# EAGLE design linefollower analog (EAGLE 6.6.0)
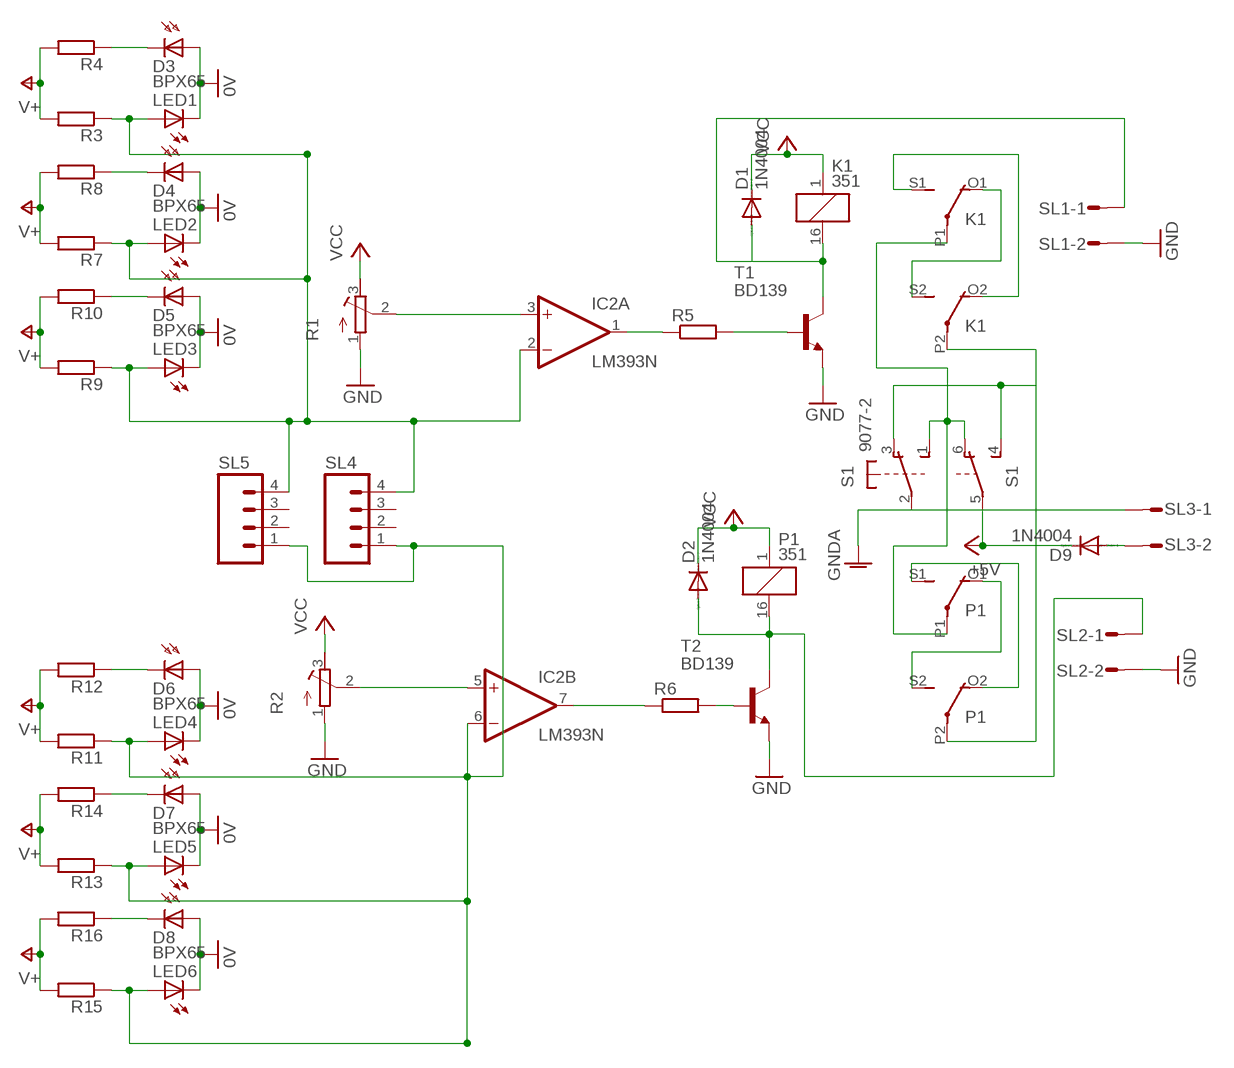
[diagram p0: schematic, sheet 1]

## Parts
D1  1N4004  [DO41-10]
D2  1N4004  [DO41-10]
D3  BPX65  [BPX65]
D4  BPX65  [BPX65]
D5  BPX65  [BPX65]
D6  BPX65  [BPX65]
D7  BPX65  [BPX65]
D8  BPX65  [BPX65]
D9  1N4004  [DO41-10]
IC2  LM393N  [DIL08]
K1  351  [351]
LED1  LED5MM  [LED5MM]
LED2  LED5MM  [LED5MM]
LED3  LED5MM  [LED5MM]
LED4  LED5MM  [LED5MM]
LED5  LED5MM  [LED5MM]
LED6  LED5MM  [LED5MM]
P1  351  [351]
R1  R-TRIMM3339P  [RTRIM3339P]
R2  R-TRIMM3339P  [RTRIM3339P]
R3  R-EU_0204/7  [0204/7]
R4  R-EU_0204/7  [0204/7]
R5  R-EU_0207/7  [0207/7]
R6  R-EU_0207/7  [0207/7]
R7  R-EU_0204/7  [0204/7]
R8  R-EU_0204/7  [0204/7]
R9  R-EU_0204/7  [0204/7]
R10  R-EU_0204/7  [0204/7]
R11  R-EU_0204/7  [0204/7]
R12  R-EU_0204/7  [0204/7]
R13  R-EU_0204/7  [0204/7]
R14  R-EU_0204/7  [0204/7]
R15  R-EU_0204/7  [0204/7]
R16  R-EU_0204/7  [0204/7]
S1  9077-2  [9077-2]
SL1  M02S  [02P]
SL2  M02S  [02P]
SL3  M02S  [02P]
SL4  M04  [04P]
SL5  M04  [04P]
T1  BD139  [TO126]
T2  BD139  [TO126]

## Nets
0V: D3.A D4.A D5.A D6.A D7.A D8.A LED1.K(C) LED2.K(C) LED3.K(C) LED4.K(C) LED5.K(C) LED6.K(C)
+5V: D9.C S1.2(1:P) SL3.1 ; supply symbol labelled GNDA
GND: R1.1(E) R2.1(E) SL1.2 SL2.2 T1.1(E) T2.1(E)
N$1: IC2.3(A:+IN) R1.2(S)
N$2: IC2.5(B:+IN) R2.2(S)
N$3: IC2.7(B:OUT) R6.1
N$4: IC2.1(A:OUT) R5.1
N$5: R5.2 T1.3(B)
N$6: R6.2 T2.3(B)
N$7: IC2.6(B:-IN) LED4.A LED5.A LED6.A R11.1 R13.1 R15.1 SL4.1 SL5.1
N$8: D1.A K1.16 SL1.1 T1.2(C)
N$10: D9.A SL3.2
N$11: K1.O2(3:O) K1.S1(2:S)
N$12: K1.O1(2:O) K1.S2(3:S)
N$13: K1.P1(2:P) P1.P1(2:P) S1.1(1:S) S1.6(2:O)
N$14: K1.P2(3:P) P1.P2(3:P) S1.3(1:O) S1.4(2:S)
N$15: P1.O2(3:O) P1.S1(2:S)
N$16: P1.O1(2:O) P1.S2(3:S)
N$18: D3.K(C) R4.1
N$19: IC2.2(A:-IN) LED1.A LED2.A LED3.A R3.1 R7.1 R9.1 SL4.4 SL5.4
N$22: D4.K(C) R8.1
N$26: D5.K(C) R10.1
N$30: D6.K(C) R12.1
N$34: D7.K(C) R14.1
N$38: D8.K(C) R16.1
P1: D2.A P1.16 SL2.1 T2.2(C)
V+: R3.2 R4.2 R7.2 R8.2 R9.2 R10.2 R11.2 R12.2 R13.2 R14.2 R15.2 R16.2
VCC: D1.C D2.C K1.1 P1.1 R1.3(A) R2.3(A)
Unconnected: S1.5(2:P) SL4.2 SL4.3 SL5.2 SL5.3

## Power pins joined to a net without a drawn wire
GND: IC2.4(P:V-)
VCC: IC2.8(P:V+)

## Library data of the parts
D1 D2 D9 = diode:1N4004: DIODE general purpose rectifier, 1 A
D3-D8 = opto-trans-siemens:BPX65: PHOTO DIODE; MPN: BPX65.; OC_FARNELL: 327451; OC_NEWARK: 06WX2764
IC2 = linear:LM393: COMPARATOR
K1 P1 = relay:351: RELAY 2 x switch, Omron; OC_FARNELL: unknown; OC_NEWARK: unknown
LED1-LED6 = led:LED: LED OSRAM: - CHIPLED LG R971, LG N971, LY N971, LG Q971, LY Q971, LO R971, LY R971 LH N974, LH R974 LS Q976, LO Q976, LY Q976 LO Q996 - Hyper CHIPLED LW Q18S LB Q993, LB Q99A, LB R99A - SideLED LS A670, LO A670, LY A670, LG A670, LP A670 LB A673, LV A673, LT A673, LW A673 LH A674 LY A675 LS A676, LA A676, LO A676, LY A676, LW A676 LS A679, LY A679, LG A679 - Hyper Micro SIDELED® LS Y876, LA Y876, LO Y876, LY Y876 LT Y87S - SmartLED LW L88C, LW L88S LB L89C, LB L89S, LG L890 LS L89K, LO L89K, LY L89K LS L896, LA L896, LO L896, LY L896 - TOPLED LS T670, LO T670, LY T670, LG T670, LP T670 LSG T670, LSP T670, LSY T670, LOP T670, LYG T670 LG T671, LOG T671, LSG T671 LB T673, LV T673, LT T673, LW T673 LH T674 LS T676, LA T676, LO T676, LY T676, LB T676, LH T676, LSB T676, LW T676 LB T67C, LV T67C, LT T67C, LS T67K, LO T67K, LY T67K, LW E67C LS E67B, LA E67B, LO E67B, LY E67B, LB E67C, LV E67C, LT E67C LW T67C LS T679, LY T679, LG T679 LS T770, LO T770, LY T770, LG T770, LP T770 LB T773, LV T773, LT T773, LW T773 LH T774 LS E675, LA E675, LY E675, LS T675 LS T776, LA T776, LO T776, LY T776, LB T776 LHGB T686 LT T68C, LB T68C - Hyper Mini TOPLED® LB M676 - Mini TOPLED Santana® LG M470 LS M47K, LO M47K, LY M47K Source: http://www.osram.convergy.de LUXEON: - LUMILED® LXK2-PW12-R00, LXK2-PW12-S00, LXK2-PW14-U00, LXK2-PW14-V00 LXK2-PM12-R00, LXK2-PM12-S00, LXK2-PM14-U00 LXK2-PE12-Q00, LXK2-PE12-R00, LXK2-PE12-S00, LXK2-PE14-T00, LXK2-PE14-U00 LXK2-PB12-K00, LXK2-PB12-L00, LXK2-PB12-M00, LXK2-PB14-N00, LXK2-PB14-P00, LXK2-PB14-Q00 LXK2-PR12-L00, LXK2-PR12-M00, LXK2-PR14-Q00, LXK2-PR14-R00 LXK2-PD12-Q00, LXK2-PD12-R00, LXK2-PD12-S00 LXK2-PH12-R00, LXK2-PH12-S00 LXK2-PL12-P00, LXK2-PL12-Q00, LXK2-PL12-R00 Source: www.luxeon.com KINGBRIGHT: KA-3528ASYC Source: www.kingbright.com
R1 R2 = resistor:R-TRIMM: Trimm resistor
R3-R16 = resistor:R-EU_: RESISTOR, European symbol
S1 = switch-misc:9077-2: MARQUARDT SWITCH 9077.0200 Distributor: Buerklin <https://www.buerklin.com/default.asp?event=ShowArtikel%2812G2822%29&l=d&jump=ArtNr_12G2822>
SL1-SL3 = con-amp-quick:M02S: AMP QUICK CONNECTOR; OC_FARNELL: unknown; OC_NEWARK: unknown
SL4 SL5 = con-amp-quick:M04: AMP QUICK CONNECTOR; OC_FARNELL: unknown; OC_NEWARK: unknown
T1 T2 = transistor:BD139: NPN TRANSISTOR

## Board
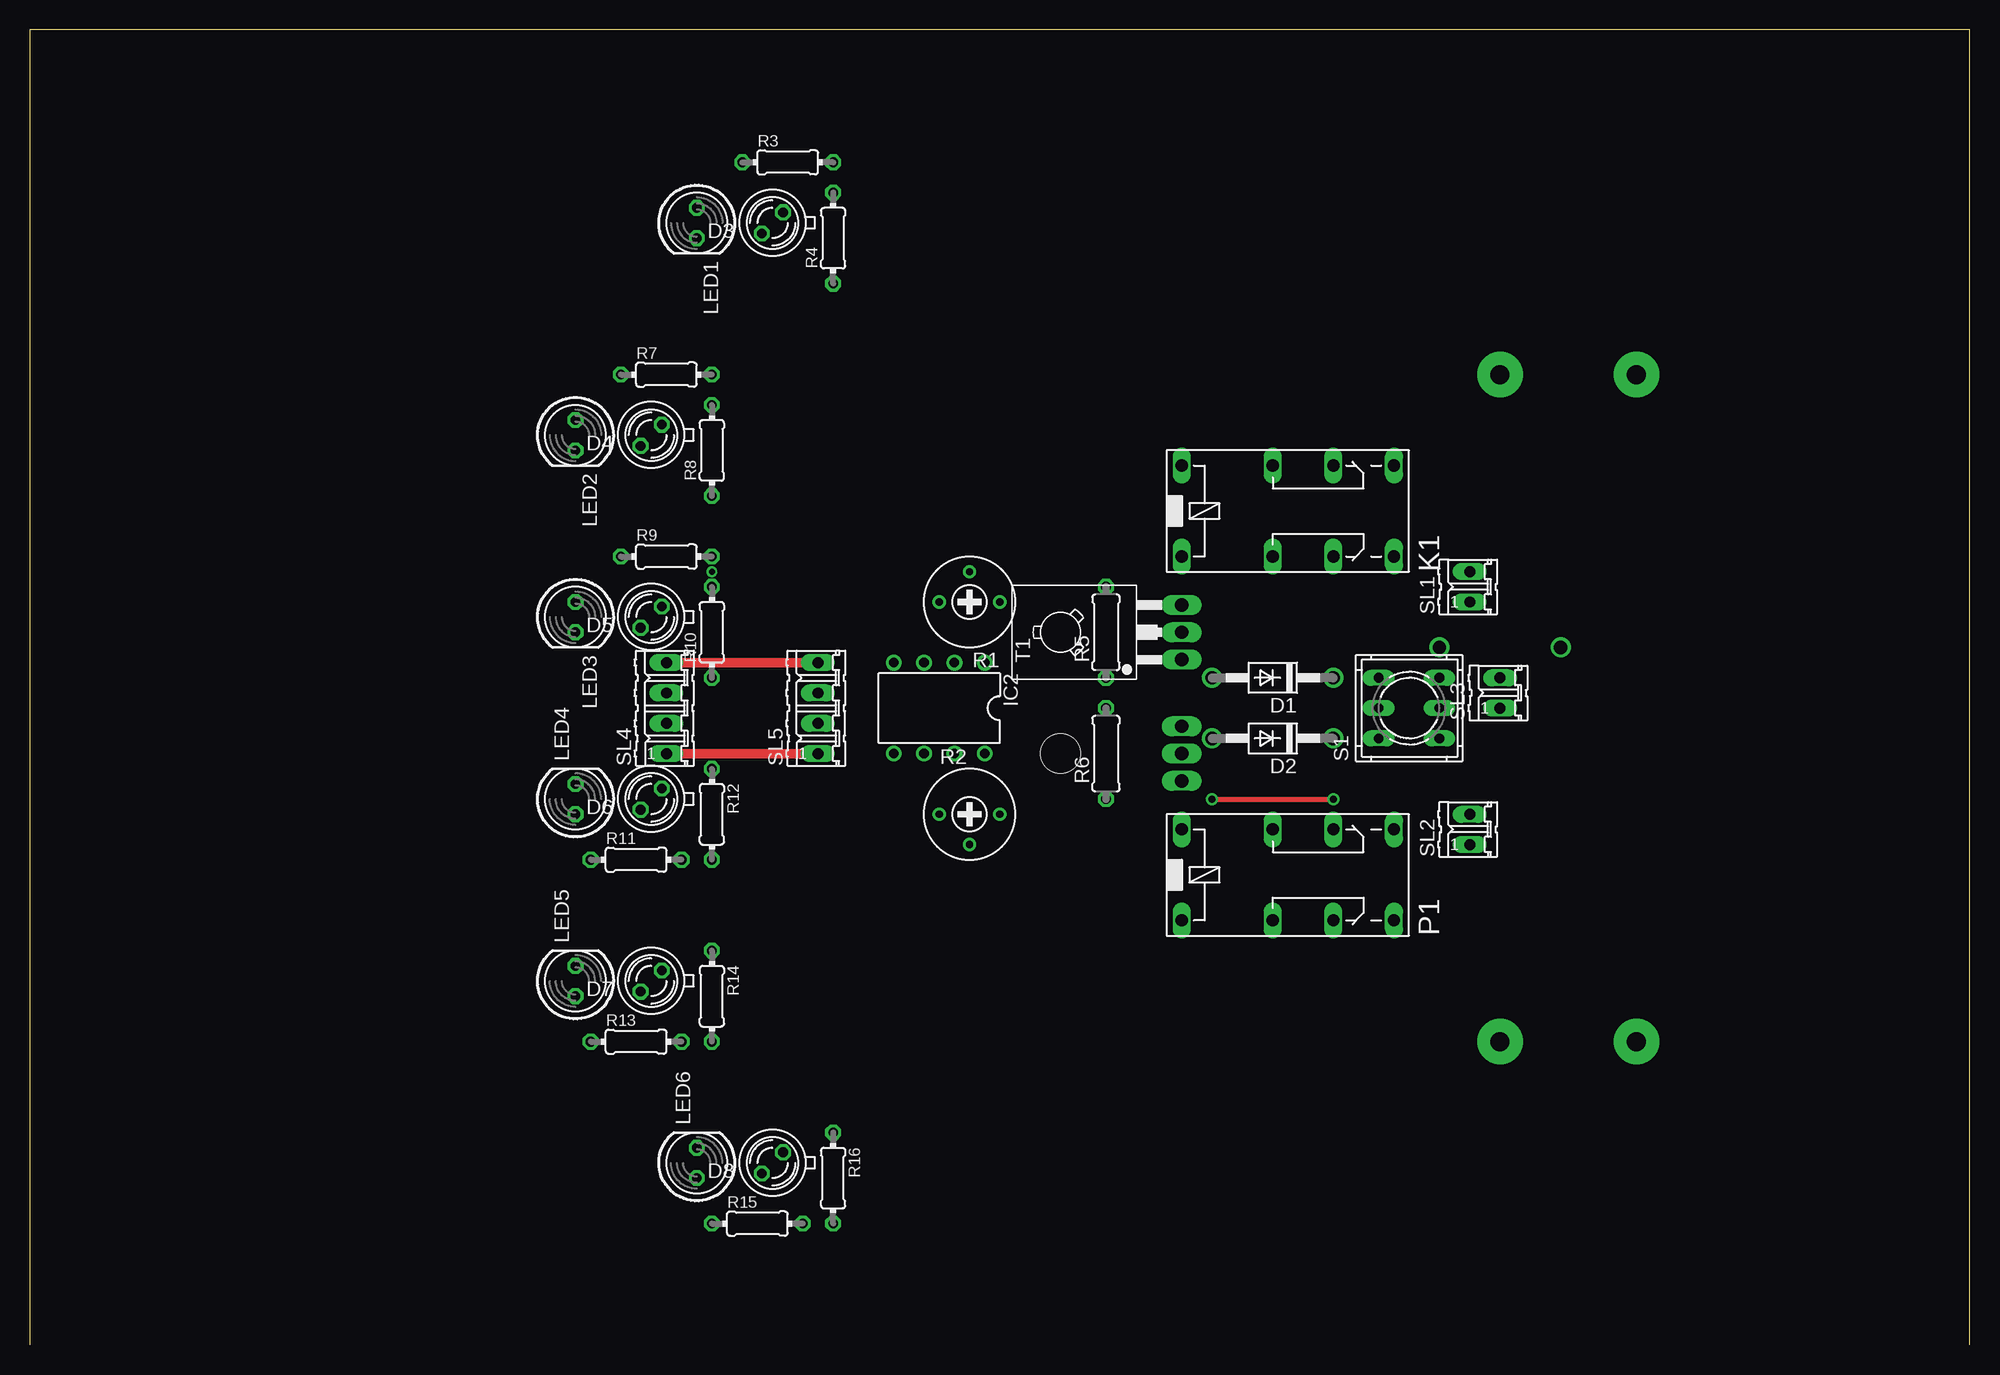
[diagram p1: board, top side]
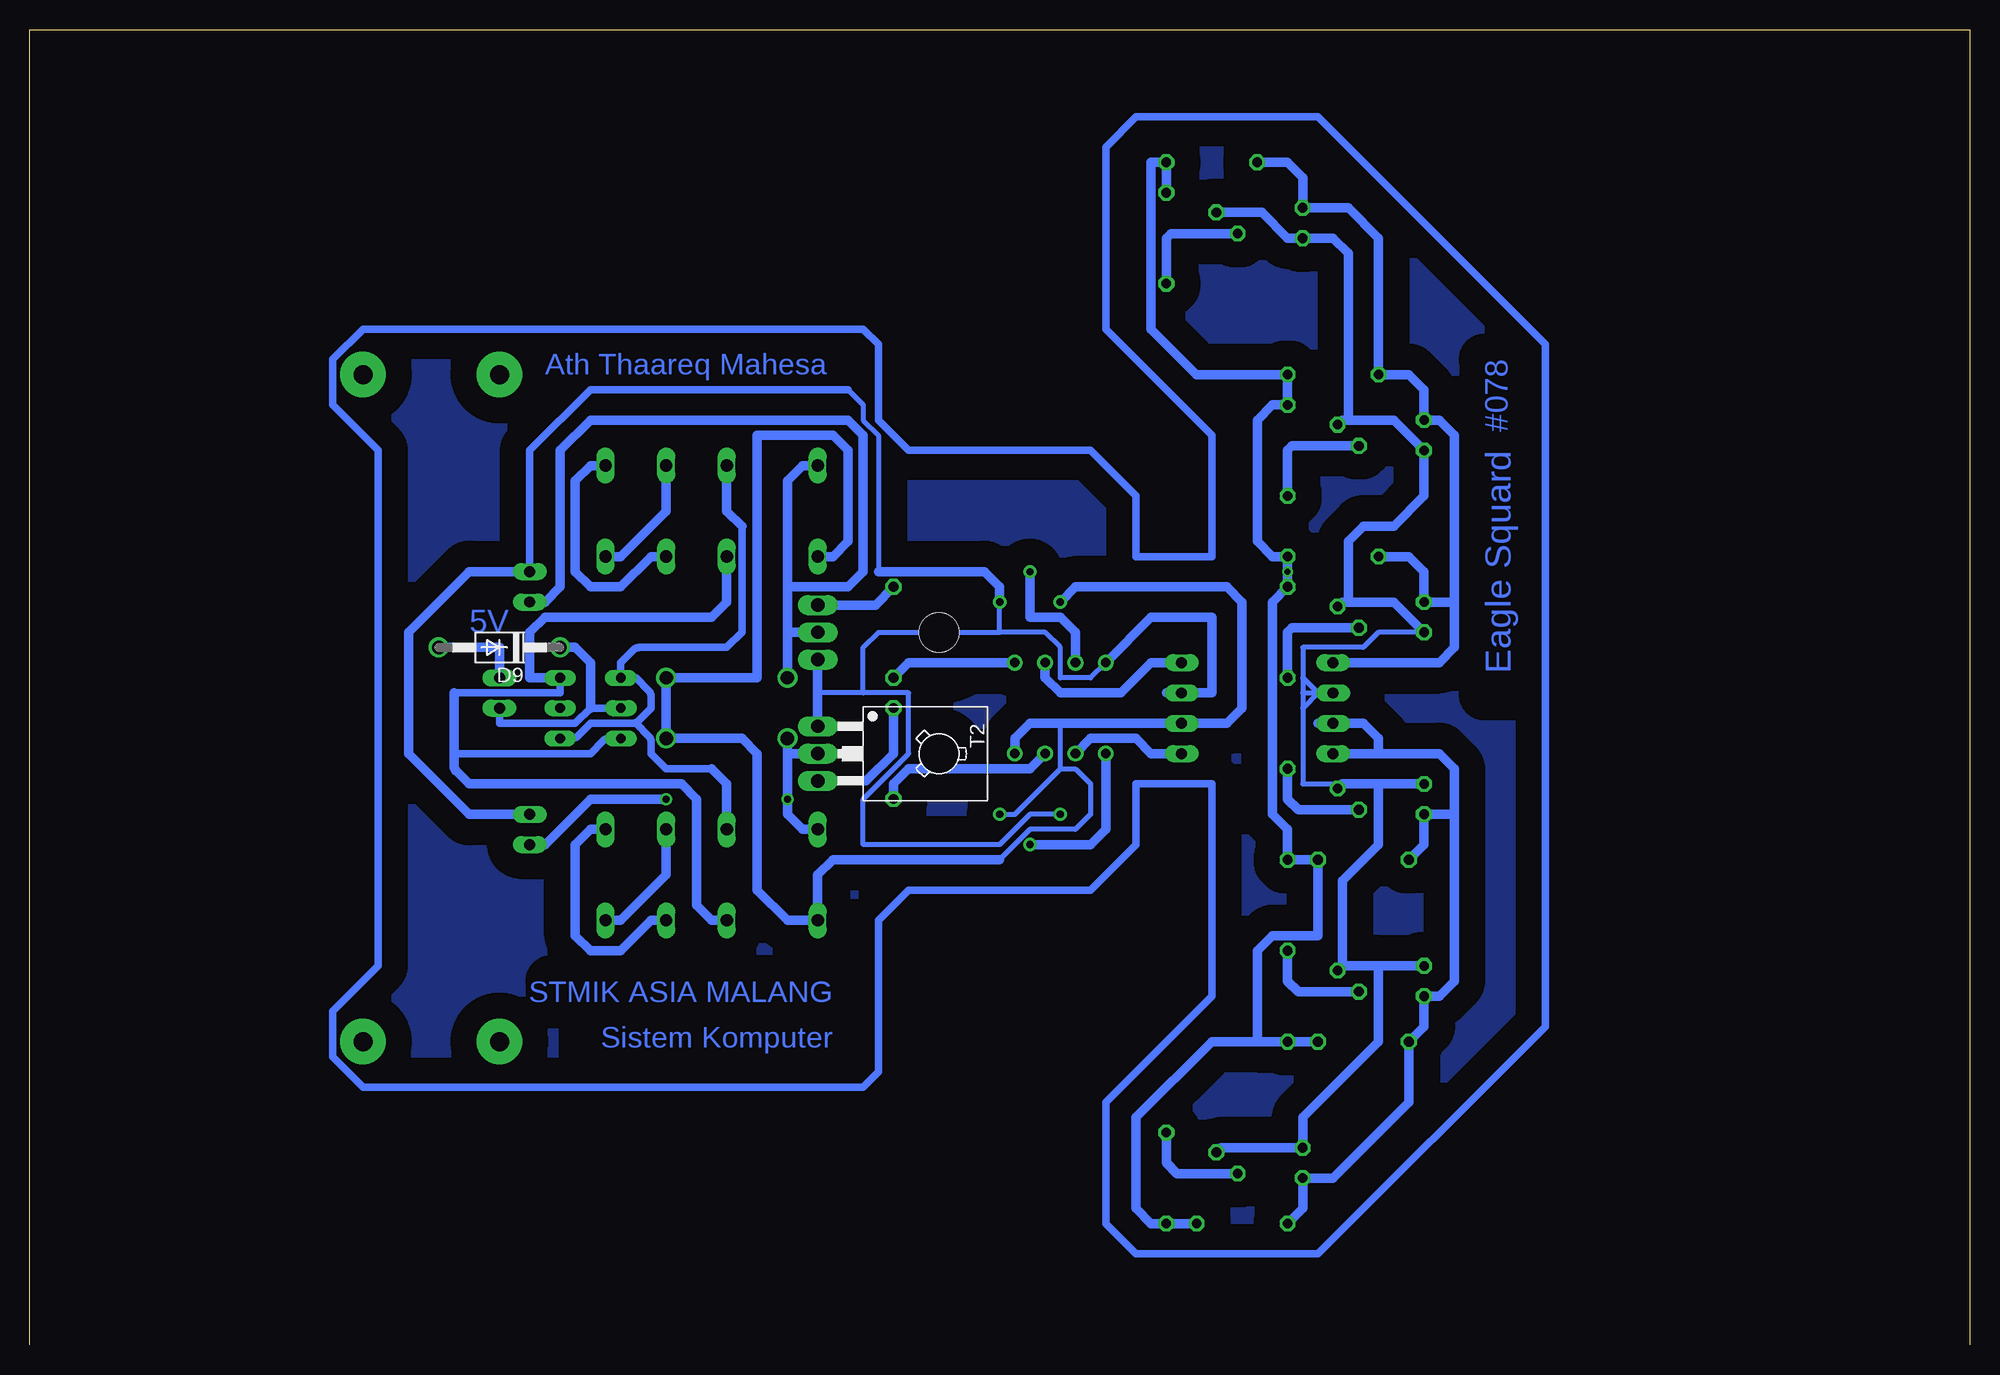
[diagram p2: board, bottom side, seen from below]

Size 162.54 x 110.16 mm. Coordinates in mm from the lower left corner, seen from the top.
Outline: 162.54,0 162.54,110.16 0,110.16 0,0
Copper layers (1*16): Top 0.035mm / dielectric 1.5mm / Bottom 0.035mm
Design rules "default": minimum track width 10mil, minimum drill 24mil, track to track 8mil, track to pad 8mil, pad to pad 8mil, via to via 8mil, smd to smd 8mil, copper to edge 40mil, drill to drill 8mil, minimum pad ring 10mil, minimum via ring 8mil, stop-mask expansion 4mil, vias tented up to drill 0mil, thermal gap 10mil

### Footprints (pad centres in the part's own frame; a part is rotated, then mirrored left to right if it is on the bottom)
DO41-10 = drill 1.118: A 5.08,0; C -5.08,0
BPX65 = drill 0.813 octagon: A -0.889,-0.889; K 0.889,0.889
DIL08 = drill 0.813 pad 1.27: 1 -3.81,-3.81; 2 -1.27,-3.81; 3 1.27,-3.81; 4 3.81,-3.81; 5 3.81,3.81; 6 1.27,3.81; 7 -1.27,3.81; 8 -3.81,3.81
351 = drill 1.016 long: 1 -3.81,-3.81; 16 -3.81,3.81; O1 8.89,-3.81; O2 8.89,3.81; P1 3.81,-3.81; P2 3.81,3.81; S1 13.97,-3.81; S2 13.97,3.81
LED5MM = drill 0.813 octagon: A -1.27,0; K 1.27,0
RTRIM3339P = drill 0.61: 1 -2.54,0; 2 0,-2.54; 3 2.54,0
0204/7 = drill 0.813 octagon: 1 -3.81,0; 2 3.81,0
0207/7 = drill 0.813 octagon: 1 -3.81,0; 2 3.81,0
9077-2 = drill 0.813 long: 1 -2.54,2.54; 2 0,2.54; 3 2.54,2.54; 4 -2.54,-2.54; 5 0,-2.54; 6 2.54,-2.54
02P = drill 0.914 long: 1 -1.27,0; 2 1.27,0
04P = drill 0.914 long: 1 -3.81,0; 2 -1.27,0; 3 1.27,0; 4 3.81,0
TO126 = drill 1.118 long: 1 -2.286,-5.08; 2 0,-5.08; 3 2.286,-5.08 | hole 3.302: 0,5.08

### Placement (x,y rotation side)
D1  104.14,55.88 180 top
D2  104.14,50.8 180 top
D3  62.23,93.98 180 top
D4  52.07,76.2 180 top
D5  52.07,60.96 180 top
D6  52.07,45.72 180 top
D7  52.07,30.48 180 top
D8  62.23,15.24 180 top
D9  123.19,58.42 180 bottom
IC2  76.2,53.34 180 top
K1  100.33,69.85 0 top
LED1  55.88,93.98 270 top
LED2  45.72,76.2 270 top
LED3  45.72,60.96 270 top
LED4  45.72,45.72 90 top
LED5  45.72,30.48 90 top
LED6  55.88,15.24 90 top
P1  100.33,39.37 0 top
R1  78.74,62.23 180 top
R2  78.74,44.45 0 top
R3  63.5,99.06 0 top
R4  67.31,92.71 90 top
R5  90.17,59.69 90 top
R6  90.17,49.53 90 top
R7  53.34,81.28 0 top
R8  57.15,74.93 90 top
R9  53.34,66.04 0 top
R10  57.15,59.69 90 top
R11  50.8,40.64 0 top
R12  57.15,44.45 270 top
R13  50.8,25.4 0 top
R14  57.15,29.21 270 top
R15  60.96,10.16 0 top
R16  67.31,13.97 270 top
S1  115.57,53.34 90 top
SL1  120.65,63.5 90 top
SL2  120.65,43.18 90 top
SL3  123.19,54.61 90 top
SL4  53.34,53.34 90 top
SL5  66.04,53.34 90 top
T1  91.44,59.69 90 top
T2  91.44,49.53 270 bottom

### Tracks (layer width: path | path; a pad name or v marks a point on that pad's centre or on a via)
0V
  Bottom 0.406: LED3.K 49.53,59.69 50.8,58.42 55.88,58.42 55.88,55.88 | 55.88,55.88 55.88,54.61 | 55.88,54.61 55.88,53.34 | 55.88,53.34 55.88,46.99 52.07,46.99 | 55.88,54.61 54.61,54.61 | 54.61,54.61 52.07,54.61 | 55.88,55.88 54.61,54.61 | 54.61,54.61 55.88,53.34
  Bottom 0.813: 52.07,77.47 48.26,77.47 LED2.K 45.72,71.12 48.26,68.58 50.8,68.58 52.07,67.31 52.07,62.23 | 52.07,77.47 52.58,77.47 D4.A | LED3.K 48.26,62.23 52.07,62.23 | 52.07,62.23 52.58,62.23 D5.A | 49.53,31.75 52.58,31.75 | D8.A 62.74,16.51 LED6.K 55.88,19.05 49.53,25.4 49.53,31.75 | 49.53,31.75 LED5.K | 52.58,31.75 D7.A | 52.58,31.75 52.58,38.86 49.53,41.91 49.53,46.99 | LED4.K 49.53,46.99 | 49.53,46.99 52.07,46.99 52.58,46.99 D6.A | D3.A 59.31,94.87 57.15,92.71 LED1.K 53.34,92.71 52.07,91.44 52.07,77.47
+5V
  Bottom 0.61: S1.2 115.57,53.34 116.84,52.07 123.19,52.07 SL3.1
  Bottom 0.813: D9.C 116.84,58.42 115.57,57.15 115.57,53.34
GND
  Bottom 0.406: IC2.4 73.66,55.88 76.2,55.88 76.2,58.42 77.47,59.69 81.28,59.69 | 81.28,59.69 R1.1 | R2.1 78.74,44.45 81.28,41.91 92.71,41.91 92.71,45.72 88.9,49.53 88.9,54.61 92.71,54.61 | 92.71,54.61 96.52,54.61 | 92.71,54.61 92.71,58.42 91.44,59.69 81.28,59.69 | 93.98,80.01 92.71,78.74 92.71,77.47 91.44,76.2 91.44,64.77
  Bottom 0.61: SL1.2 120.65,74.93 115.57,80.01 93.98,80.01
  Bottom 0.813: T1.1 96.52,54.61 T2.1 | IC2.4 68.58,60.96 63.5,60.96 63.5,54.61 67.31,54.61 | SL2.2 125.73,44.45 130.81,49.53 130.81,59.69 125.73,64.77 SL1.2 | 91.44,64.77 82.55,64.77 81.28,63.5 R1.1
N$1
  Bottom 0.813: R1.2 78.74,60.96 76.2,60.96 74.93,59.69 IC2.3
N$2
  Bottom 0.813: IC2.5 72.39,43.18 73.66,41.91 R2.2
N$3
  Bottom 0.813: R6.1 90.17,46.99 88.9,48.26 78.74,48.26 IC2.7
N$4
  Bottom 0.813: R5.1 88.9,57.15 IC2.1
N$5
  Bottom 0.813: T1.3 91.69,61.98 R5.2
N$6
  Bottom 0.813: T2.3 92.46,47.24 90.17,49.53 R6.2
N$7
  Top 0.813: SL4.1 SL5.1
  Bottom 0.813: 54.61,52.07 50.8,52.07 49.53,50.8 49.53,49.53 | R15.1 55.88,11.43 LED6.A 53.34,13.97 46.99,20.32 R13.1 45.72,26.67 LED5.A 44.45,29.21 43.18,30.48 43.18,44.45 | 43.18,44.45 43.18,48.26 44.45,49.53 49.53,49.53 | R11.1 45.72,41.91 LED4.A 43.18,44.45 | SL4.1 49.53,49.53 | IC2.6 73.66,50.8 69.85,50.8 68.58,49.53 SL5.1
N$8
  Bottom 0.813: 99.06,63.5 99.06,72.39 97.79,73.66 K1.16 | 99.06,63.5 99.06,59.69 | 99.06,59.69 T1.2 | D1.A 99.06,59.69 | SL1.1 119.38,62.23 118.11,63.5 118.11,74.93 115.57,77.47 93.98,77.47 92.71,76.2 92.71,64.77 93.98,63.5 99.06,63.5
N$9
  pour Bottom (isolate 2.184): 34.29,85.09 53.34,104.14 71.12,104.14 73.66,101.6 73.66,83.82 64.77,74.93 64.77,67.31 68.58,67.31 68.58,72.39 73.66,77.47 88.9,77.47 90.17,78.74 90.17,85.09 91.44,86.36 135.89,86.36 138.43,83.82 138.43,77.47 134.62,73.66 134.62,33.02 138.43,29.21 138.43,22.86 135.89,20.32 91.44,20.32 88.9,22.86 88.9,35.56 87.63,36.83 72.39,36.83 68.58,40.64 68.58,45.72 64.77,45.72 64.77,30.48 73.66,21.59 73.66,8.89 71.12,6.35 53.34,6.35 33.02,26.67 33.02,83.82
N$10
  Bottom 0.813: D9.A 123.19,58.42 SL3.2
N$11
  Bottom 0.813: K1.O2 109.22,69.85 113.03,66.04 K1.S1
N$12
  Bottom 0.813: K1.S2 115.57,73.66 116.84,72.39 116.84,64.77 115.57,63.5 113.03,63.5 110.49,66.04 K1.O1
N$13
  Bottom 0.61: S1.1 114.04,50.8 arc-45 114.49,50.61 115.57,49.53 127,49.53 | 127,54.61 118.11,54.61 S1.6
  Bottom 0.813: P1.P1 105.41,35.56 106.68,36.83 106.68,45.72 107.95,46.99 125.73,46.99 126.81,48.07 arc45 127,48.52 127,49.53 127,54.61 | S1.6 120.65,55.88 120.65,59.69 119.38,60.96 105.41,60.96 104.14,62.23 K1.P1
N$14
  Bottom 0.61: 102.87,68.58 102.87,59.69 104.14,58.42 111.5,58.42 arc-45 111.95,58.23 113.03,57.15 S1.3 111.76,55.88 110.68,54.8 arc45 110.49,54.35 110.49,53.34 111.57,52.26 arc45 112.02,52.07 | 105.41,48.26 109.22,48.26 110.49,49.53 110.49,50.54 arc-45 110.68,50.99 111.76,52.07 112.02,52.07 | S1.4 117.1,50.8 arc-45 116.65,50.99 115.57,52.07 112.02,52.07
  Bottom 0.813: K1.P2 104.14,69.85 102.87,68.58 | P1.P2 104.14,46.99 105.41,48.26
N$15
  Bottom 0.813: P1.S1 113.03,35.56 109.22,39.37 P1.O2
N$16
  Bottom 0.813: P1.O1 110.49,35.56 113.03,33.02 115.57,33.02 116.84,34.29 116.84,41.91 115.57,43.18 P1.S2
N$17  (via drill 1.6 pad 3.81)
  other vias: 134.62,25.4
N$18
  Bottom 0.813: D3.K 66.93,93.09 67.31,92.71 R4.1
N$19
  Top 0.813: SL5.4 SL4.4
  Bottom 0.813: R9.1 46.99,66.04 45.72,64.77 LED3.A 43.18,62.23 | 43.18,62.23 43.18,76.2 44.45,77.47 LED2.A 45.72,80.01 46.99,81.28 R7.1 49.53,92.71 52.07,95.25 LED1.A 55.88,97.79 57.15,99.06 R3.1 | 43.18,62.23 43.18,58.42 44.45,57.15 SL4.4 | IC2.2 77.47,55.88 76.2,54.61 71.12,54.61 68.58,57.15 SL5.4
N$20  (via drill 1.6 pad 3.81)
  other vias: 123.19,25.4
N$21  (via drill 1.6 pad 3.81)
  other vias: 134.62,81.28
N$22
  Bottom 0.813: D4.K 56.77,75.31 57.15,74.93 R8.1
N$23  (via drill 1.6 pad 3.81)
  other vias: 123.19,81.28
N$24
  Bottom 0.61: 92.71,85.09 91.44,83.82 91.44,77.47 88.9,74.93 73.66,74.93 69.85,71.12 69.85,66.04 63.5,66.04 63.5,76.2 72.39,85.09 72.39,100.33 69.85,102.87 54.61,102.87 35.56,83.82 35.56,26.67 54.61,7.62 69.85,7.62 72.39,10.16 72.39,20.32 63.5,29.21 63.5,46.99 69.85,46.99 69.85,41.91 73.66,38.1 88.9,38.1 91.44,35.56 91.44,22.86 92.71,21.59 134.62,21.59 137.16,24.13 137.16,27.94 133.35,31.75 133.35,74.93 137.16,78.74 137.16,82.55 134.62,85.09 92.71,85.09
N$26
  Bottom 0.813: D5.K 56.77,60.07 57.15,59.69 R10.1
N$30
  Bottom 0.813: D6.K 56.26,44.83 57.15,45.72 R12.1
N$34
  Bottom 0.813: D7.K 56.26,29.59 57.15,30.48 R14.1
N$38
  Bottom 0.813: D8.K 66.42,14.35 67.31,15.24 R16.1
P1  (via drill 0.6)
  Top 0.406: v99.06,45.72 v109.22,45.72
  Bottom 0.813: P1.16 97.79,43.18 99.06,44.45 v99.06,45.72 99.06,49.53 | 99.06,49.53 T2.2 | D2.A 99.06,49.53 | SL2.1 119.38,41.91 115.57,45.72 v109.22,45.72
V+  (via drill 0.5 pad 0.25)
  Bottom 0.813: R13.2 R14.2 59.69,25.4 | R15.2 R16.2 68.58,10.16 69.85,11.43 69.85,19.05 63.5,25.4 59.69,25.4 | 59.69,25.4 59.69,33.02 58.42,34.29 54.61,34.29 R11.2 R12.2 57.15,43.18 58.42,44.45 58.42,62.23 R10.2 v57.15,64.77 R9.2 58.42,66.04 59.69,67.31 59.69,77.47 58.42,78.74 R8.2 R7.2 64.77,81.28 68.58,85.09 68.58,99.06 R3.2 R4.2
VCC
  Bottom 0.406: 76.2,48.26 76.2,52.07 | R2.3 80.01,44.45 76.2,48.26 | 76.2,48.26 74.93,48.26 73.66,46.99 73.66,44.45 74.93,43.18 78.74,43.18 81.28,40.64
  Bottom 0.813: K1.1 95.25,66.04 93.98,67.31 93.98,74.93 95.25,76.2 101.6,76.2 101.6,55.88 D1.C D2.C 102.87,50.8 101.6,49.53 101.6,38.1 99.06,35.56 P1.1 96.52,39.37 95.25,40.64 81.28,40.64 | R1.3 74.93,63.5 62.23,63.5 60.96,62.23 60.96,53.34 62.23,52.07 76.2,52.07 78.74,52.07 80.01,50.8 IC2.8

### Text on the board
Bottom: #078 | Ath Thaareq Mahesa | Eagle Squard | 5V | STMIK ASIA MALANG | Sistem Komputer